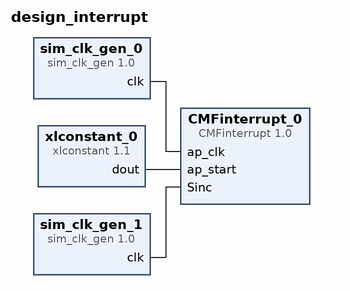
[diagram p0: block diagram of the top level]
# Vivado block design design_interrupt, xc7z020clg484-1, Vivado 2018.3
create_bd_design design_interrupt

create_bd_cell -type ip -vlnv xilinx.com:user:CMFinterrupt:1.0 CMFinterrupt_0
create_bd_cell -type ip -vlnv xilinx.com:ip:sim_clk_gen:1.0 sim_clk_gen_0
create_bd_cell -type ip -vlnv xilinx.com:ip:xlconstant:1.1 xlconstant_0
create_bd_cell -type ip -vlnv xilinx.com:ip:sim_clk_gen:1.0 sim_clk_gen_1
set_property -dict {CONFIG.FREQ_HZ 10000000} [get_bd_cells sim_clk_gen_1]

# ---- connections ----

connect_bd_net [get_bd_pins sim_clk_gen_0/clk] [get_bd_pins CMFinterrupt_0/ap_clk]
connect_bd_net [get_bd_pins xlconstant_0/dout] [get_bd_pins CMFinterrupt_0/ap_start]
connect_bd_net [get_bd_pins sim_clk_gen_1/clk] [get_bd_pins CMFinterrupt_0/Sinc]

validate_bd_design
save_bd_design
